# Altium project Common_ASIC_tester.PrjPcb (part 2 of 2)

## Sheet POWER.SchDoc: Panel
size 420 x 297 mm; Author: G.Kasprowicz; CompanyName: WUT ISE; DrawnBy: G.Kasprowicz; Organization: WUT ISE; Address1: PW ISE; Address2: Nowowiejska 15/19 00-665 Warsaw; Address3: gkasprow@gmail.com; DocumentNumber: 3; Revision: 2; SheetNumber: 3; SheetTotal: 3; ModifiedBy: -; CheckedDate: -; Title2: Power supply; DivGrp: WUT ISE; Designer: G.Kasprowicz; ModifiedDate: -; ProjectName: Sensor Box
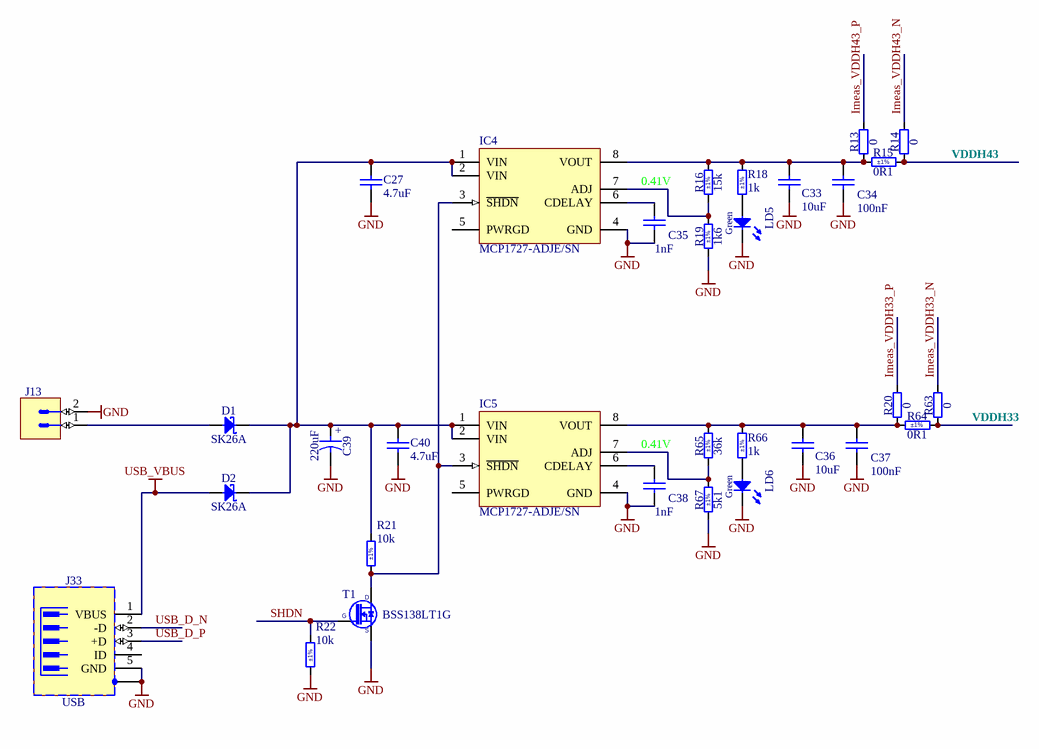
[diagram p3: POWER.SchDoc]

### Parts
C27  4.7uF  [CAPC1005X55N]
C33  10uF  [CAPC1608X80N]
C34  100nF  [CAPC1005X55N]
C35  1nF  [CAPC1005X55N]
C36  10uF  [CAPC1608X80N]
C37  100nF  [CAPC1005X55N]
C38  1nF  [CAPC1005X55N]
C39  220uF  [CAPMP7343X430N]
C40  4.7uF  [CAPC1005X55N]
D1  SK26A  [DIOM5126X265N]
D2  SK26A  [DIOM5126X265N]
IC4  MCP1727-ADJE/SN  [SO-8]
IC5  MCP1727-ADJE/SN  [SO-8]
J13  (no value)  [PHOENIX_1755736]
J33  USB  [MOLEX_500075-1517]
LD5  Green  [LED_KINGBRIGHT_KP-1608CGCK]
LD6  Green  [LED_KINGBRIGHT_KP-1608CGCK]
R13  0  [RESC1005X40N]
R14  0  [RESC1005X40N]
R15  0R1  Tolerance: ±1%  [RESC1608X55N]
R16  15k  Tolerance: ±1%  [RESC1005X40N]
R18  1k  Tolerance: ±1%  [RESC1005X40N]
R19  1k6  Tolerance: ±1%  [RESC1005X40N]
R20  0  [RESC1005X40N]
R21  10k  Tolerance: ±1%  [RESC1005X40N]
R22  10k  Tolerance: ±1%  [RESC1005X40N]
R63  0  [RESC1005X40N]
R64  0R1  Tolerance: ±1%  [RESC1608X55N]
R65  36k  Tolerance: ±1%  [RESC1005X40N]
R66  1k  Tolerance: ±1%  [RESC1005X40N]
R67  5k1  Tolerance: ±1%  [RESC1005X40N]
T1  BSS138LT1G  [SOT95P240X110-3N]

### Nets
GND: C27.1 C33.1 C34.1 C35.1 C36.1 C37.1 C38.1 C39.2 C40.1 IC4.4(GND) IC5.4(GND) J13.2 J33.5(GND) J33.6(SH) LD5.1(C) LD6.1(C) R19.1 R22.2 R67.1 T1.2(S)
USB_VBUS: D2.2(A) J33.1(VBUS)
Imeas_VDDH33_N: R63.2
Imeas_VDDH33_P: R20.2
Imeas_VDDH43_N: R14.2
Imeas_VDDH43_P: R13.2
SHDN: R22.1 T1.1(G)
USB_D_N: J33.2(-D)
USB_D_P: J33.3(+D)
VDDH33: R63.1 R64.2
VDDH43: R14.1 R15.2
NetC27_2: C27.2 C39.1 C40.2 D1.1(C) D2.1(C) IC4.1(VIN) IC4.2(VIN) IC5.1(VIN) IC5.2(VIN) R21.1
NetC33_2: C33.2 C34.2 IC4.8(VOUT) R13.1 R15.1 R16.2 R18.2
NetC35_2: C35.2 IC4.6(CDELAY)
NetC36_2: C36.2 C37.2 IC5.8(VOUT) R20.1 R64.1 R65.2 R66.2
NetC38_2: C38.2 IC5.6(CDELAY)
NetD1_2: D1.2(A) J13.1
NetIC4_3: IC4.3(~{SHDN}) IC5.3(~{SHDN}) R21.2 T1.3(D)
NetIC4_7: IC4.7(ADJ) R16.1 R19.2
NetIC5_7: IC5.7(ADJ) R65.1 R67.2
NetLD5_2: LD5.2(A) R18.1
NetLD6_2: LD6.2(A) R66.1

Not connected (* = marked no-connect by the designer): IC4 5(PWRGD); IC5 5(PWRGD); J33 4(ID)

### Notes on the sheet
- 0.41V
- Project/Equipment
- Document
- Designer
- Drawn by
- Check.by
- Copyright WUT ISE 2020.
  This documentation describes Open Hardware and is licensed under the CERN OHL v.1.2. You may redistribute and modify this documentation under the terms of the CERN OHL v.1.2. (http://ohwr.org/CERNOHL). This documentation is distributed WITHOUT ANY EXPRESS OR IMPLIED WARRANTY, INCLUDING OF MERCHANTABILITY, SATISFACTORY QUALITY AND FITNESS FOR A PARTICULAR PURPOSE. Please see the CERN OHL v.1.2 for applicable conditions.
- Contact
- File
- Last Mod.
- Print Date
- Sheet
- Size
- A3
- of
- Rev
- (in symbol CTE7343-43_220UF_16V_10%) +

### Library data of the parts
C27 C40 = CC0402_4.7UF_10V_10%_X5R: Non-polarised capacitor; Part Description: SMD Multilayer Chip Ceramic Capacitor; Manufacturer: GENERIC; Manufacturer1 Part Number: C1005X5R1A475K050; Voltage: 10V; TC: X5R; Tolerance: ±10%; Value: 4.7uF; Part Number: CC0402_4.7UF_10V_10%_X5R; Component Kind: Standard; Component Type: Standard; Pin Count: 2; Status: Preferred; Manufacturer Part Number: CC0402_4.7UF_10V_10%_X5R; Case: 0402; Mounted: Yes; Socket: No; SMD: Yes; Sense: No; Manufacturer1 Example: TDK; Manufacturer1 ComponentHeight: 0.65mm; HelpURL: \\cern.ch\dfs\Applications\Altium\Datasheets\CC0402_X5R_TDK_C.pdf; Author: CERN DEM BC; CreateDate: 10.01.2020; LatestRevisionDate: 10.01.2020
C33 C36 = CC0603_10UF_10V_10%_X5R: Non-polarised capacitor; Part Description: SMD Multilayer Chip Ceramic Capacitor; Manufacturer: GENERIC; Manufacturer1 Part Number: GRM188R61A106KE69D; Voltage: 10V; TC: X5R; Tolerance: ±10%; Value: 10uF; Part Number: CC0603_10UF_10V_10%_X5R; Component Kind: Standard; Component Type: Standard; Pin Count: 2; Status: None; Manufacturer Part Number: CC0603_10UF_10V_10%_X5R; Case: 0603; Mounted: Yes; Socket: No; SMD: Yes; Sense: No; Manufacturer1 Example: MURATA; Manufacturer1 ComponentHeight: 0.8mm; HelpURL: \\cern.ch\dfs\Applications\Altium\Datasheets\CC0603_MURATA_GRM188R61A106KE69D.pdf; Author: CERN DEM JLC; CreateDate: 31.01.2017; LatestRevisionDate: 31.01.2017
C34 C37 = CC0402_100NF_16V_10%_X5R: Non-polarised capacitor; Part Description: SMD Multilayer Chip Ceramic Capacitor; Manufacturer: GENERIC; Manufacturer1 Part Number: GRM155R61C104KA88D; Voltage: 16V; TC: X5R; Tolerance: ±10%; Value: 100nF; Part Number: CC0402_100NF_16V_10%_X5R; Component Kind: Standard; Component Type: Standard; Pin Count: 2; Status: None; Manufacturer Part Number: CC0402_100NF_16V_10%_X5R; Case: 0402; Mounted: Yes; Socket: No; SMD: Yes; Sense: No; Manufacturer1 Example: MURATA; Manufacturer1 ComponentHeight: 0.55mm; HelpURL: \\cern.ch\dfs\Applications\Altium\Datasheets\CC0402_X5R_MURATA_GRM.pdf; Author: CERN DEM JLC; CreateDate: 10.12.2013; LatestRevisionDate: 10.12.2013
C35 C38 = CC0402_1NF_50V_5%_C0G: Non-polarised capacitor; Part Description: SMD Multilayer Chip Ceramic Capacitor; Manufacturer: GENERIC; Manufacturer1 Part Number: C0402C102J5GACTU; Voltage: 50V; TC: C0G/NP0; Tolerance: ±5%; Value: 1nF; Part Number: CC0402_1NF_50V_5%_C0G; Component Kind: Standard; Component Type: Standard; Pin Count: 2; Status: Preferred; Manufacturer Part Number: CC0402_1NF_50V_5%_C0G; Case: 0402; Mounted: Yes; Socket: No; SMD: Yes; Sense: No; Manufacturer1 Example: KEMET; Manufacturer1 ComponentHeight: 0.55mm; HelpURL: \\cern.ch\dfs\Applications\Altium\Datasheets\CC0402_C0G_KEMET_(Commercial Grade).pdf; Author: CERN DEM BC; CreateDate: 02.09.2019; LatestRevisionDate: 02.09.2019
C39 = CTE7343-43_220UF_16V_10%: Polarised capacitor; Part Description: Solid Tantalum Chip Capacitor; Manufacturer: GENERIC; Manufacturer1 Part Number: TAJE227K016R; Voltage: 16V; Tolerance: ±10%; Part Number: CTE7343-43_220UF_16V_10%; Component Kind: Standard; Component Type: Standard; Pin Count: 2; Value: 220uF; Status: Preferred; Manufacturer Part Number: CTE7343-43_220UF_16V_10%; Case: E; Mounted: Yes; Socket: No; SMD: Yes; Sense: No; Manufacturer1 Example: AVX; Manufacturer1 ComponentHeight: 4.3mm; HelpURL: \\cern.ch\dfs\Applications\Altium\Datasheets\CTE_AVX_TAJ.pdf; Author: CERN DEM JLC; CreateDate: 03.12.2007; LatestRevisionDate: 03.12.2007
D1 D2 = SK26A: Schottky Diode; Part Description: 2A, 60V Surface Mount Schottky Barrier Rectifier; Manufacturer: TAIWAN SEMICONDUCTOR; Voltage: 60V; Power: 2A; PressFit: No; Bonding: No; Part Number: SK26A; Component Kind: Standard; Component Type: Standard; Device: SK26A; PackageDescription: DO-214-AC/SMA Molded Diode, 2-Leads, Body 5.1x2.6mm, IPC Medium Density; Manufacturer Part Number: SK26A; Pin Count: 2; Case: DO-214AC; Mounted: Yes; Socket: No; SMD: Yes; Sense: No; ComponentHeight: 2.5mm; HelpURL: \\cern.ch\dfs\Applications\Altium\Datasheets\SK26A.pdf; Author: CERN DEM JMW; CreateDate: 07.08.2015; LatestRevisionDate: 07.08.2015
IC4 IC5 = MCP1727-ADJE/SN: 1.5A, Low Voltage, Low Quiescent Current LDO Regulator, 8-Pin SOIC 150mil, Extended Temperature; Value: MCP1726-ADJE/SN; Published: 29-Jan-2009; DatasheetVersion: revB, Feb-2007; PackageVersion: revAW, Oct-2008; PackageReference: SOIC-SN8; Publisher: Altium Limited; PackageDescription: 8-Lead Plastic Small Outline (SN) - Narrow, 3.90mm Body [SOIC]; Code_JEDEC: MS-012; Code_IPC: SOIC127P600-8; ComponentLink1Description: Manufacturer Link; ComponentLink1URL: http://www.microchip.com; ComponentLink2Description: Datasheet; ComponentLink2URL: http://ww1.microchip.com/downloads/en/DeviceDoc/21999b.pdf; ComponentLink3Description: Packaging Specification; ComponentLink3URL: http://ww1.microchip.com/downloads/en/PackagingSpec/00049AW.pdf
J13 = PHOENIX_1755736: Connector 2 Male; Part Description: 12A, 250V, Pitch 5.08mm, 2 Positions Header; Manufacturer: PHOENIX CONTACT; Manufacturer Part Number: 1755736 (MSTBVA 2,5/ 2-G-5,08); PressFit: No; Part Number: PHOENIX_1755736; Component Kind: Standard; Component Type: Standard; Pin Count: 2; Mounted: Yes; Socket: No; SMD: No; Sense: No; Status: None; ComponentHeight: 12mm; HelpURL: \\cern.ch\dfs\Applications\Altium\Datasheets\PHOENIX_1755736.pdf; Author: CERN DEM JLC; CreateDate: 07.12.2010; LatestRevisionDate: 07.12.2010
J33 = MOLEX_500075-1517: 5 Pin + 1 Shield USB Receptacle; Part Description: USB Mini-B Serie Type 2, Through Hole Straight Receptacle; Manufacturer: MOLEX; PressFit: No; Part Number: MOLEX_500075-1517; Component Kind: Standard; Component Type: Standard; Pin Count: 6; Family: USB; Mounted: Yes; Socket: No; SMD: No; Sense: No; Status: None; Manufacturer Part Number: 500075-1517; ComponentHeight: 7.7mm; HelpURL: \\cern.ch\dfs\Applications\Altium\Datasheets\MOLEX_500075-1517.pdf; Author: CERN DEM JLC; CreateDate: 25.07.2012; LatestRevisionDate: 25.07.2012
LD5 LD6 = LED_KINGBRIGHT_KP-1608CGCK: LED Green 1C 2A; Part Description: 1.6x0.8mm SMD Chip Green LED Lamp; PressFit: No; Bonding: No; Part Number: LED_KINGBRIGHT_KP-1608CGCK; Component Kind: Standard; Component Type: Standard; Color: Green; PackageDescription: SMT Green LED, Case 0603, Body L 1.60mm x W 0.80mm x H 1.10mm; Manufacturer: KINGBRIGHT; Manufacturer Part Number: KP-1608CGCK; Pin Count: 2; Case: 0603; Mounted: Yes; Socket: No; SMD: Yes; Sense: No; ComponentHeight: 1.1mm; HelpURL: \\cern.ch\dfs\Applications\Altium\Datasheets\LED_KINGBRIGHT_KP-1608CGCK.pdf; Author: CERN DEM HF; CreateDate: 01.10.2021; LatestRevisionDate: 01.10.2021
R13 R14 R20 R63 = R0402_0R_JUMPER: Resistor; Part Description: 1A (0.05R Max DC Resistance) Zero Ohm Jumper; Manufacturer: GENERIC; Manufacturer1 Part Number: 232270591001L; PressFit: No; Part Number: R0402_0R_JUMPER; Component Kind: Standard; Component Type: Standard; Pin Count: 2; Value: 0; Status: Not Recommended; Manufacturer Part Number: R0402_0R_JUMPER; Case: 0402; Mounted: Yes; Sense: No; Socket: No; SMD: Yes; Manufacturer1 Example: YAGEO PHYCOMP; Manufacturer1 ComponentHeight: 0.4mm; HelpURL: \\cern.ch\dfs\Applications\Altium\Datasheets\R0402_Phycomp_RC0402.pdf; Author: CERN DEM JLC; CreateDate: 03.12.2007; LatestRevisionDate: 17.10.2012
R15 R64 = R0603_0R1_1%_0.1W_200PPM: Resistor - 1%; Part Description: Low Value Chip Resistor; Manufacturer: GENERIC; Manufacturer1 Part Number: CRL0603-FW-R100ELF; Power: 0.1W; TC: ±200ppm/°C; PressFit: No; Part Number: R0603_0R1_1%_0.1W_200PPM; Component Kind: Standard; Component Type: Standard; Pin Count: 2; Value: 0R1; Status: Preferred; Manufacturer Part Number: R0603_0R1_1%_0.1W_200PPM; Case: 0603; Mounted: Yes; Sense: No; Socket: No; SMD: Yes; Manufacturer1 Example: BOURNS; Manufacturer1 ComponentHeight: 0.55mm; HelpURL: \\cern.ch\dfs\Applications\Altium\Datasheets\R0603_BOURNS_CRL.pdf; Author: CERN DEM JMW; CreateDate: 26.11.2019; LatestRevisionDate: 26.11.2019
R16 = R0402_15K_1%_0.0625W_100PPM: Resistor - 1%; Part Description: General Purpose Thick Film Chip Resistor; Manufacturer: GENERIC; Manufacturer1 Part Number: CRCW040215K0FK; TC: ±100ppm/°C; PressFit: No; Part Number: R0402_15K_1%_0.0625W_100PPM; Component Kind: Standard; Component Type: Standard; Pin Count: 2; Value: 15k; Status: None; Power: 0.0625W; Manufacturer Part Number: R0402_15K_1%_0.0625W_100PPM; Case: 0402; Mounted: Yes; Sense: No; Socket: No; SMD: Yes; Manufacturer1 Example: VISHAY; Manufacturer1 ComponentHeight: 0.4mm; HelpURL: \\cern.ch\dfs\Applications\Altium\Datasheets\R0402_VISHAY_CRCW e3.pdf; Author: CERN DEM JMW; CreateDate: 06.07.2015; LatestRevisionDate: 06.07.2015
R18 R66 = R0402_1K_1%_0.0625W_100PPM: Resistor - 1%; Part Description: General Purpose Thick Film Chip Resistor; Manufacturer: GENERIC; Manufacturer1 Part Number: 232270671002L; TC: ±100ppm/°C; PressFit: No; Value: 1k; Part Number: R0402_1K_1%_0.0625W_100PPM; Component Kind: Standard; Component Type: Standard; Pin Count: 2; Status: Not Recommended; Power: 0.0625W; Manufacturer Part Number: R0402_1K_1%_0.0625W_100PPM; Case: 0402; Mounted: Yes; Sense: No; Socket: No; SMD: Yes; Manufacturer1 Example: YAGEO PHYCOMP; Manufacturer1 ComponentHeight: 0.4mm; HelpURL: \\cern.ch\dfs\Applications\Altium\Datasheets\R0402_Phycomp_RC0402.pdf; Author: CERN DEM JLC; CreateDate: 03.12.2007; LatestRevisionDate: 17.10.2012
R19 = R0402_1K6_1%_0.0625W_100PPM: Resistor - 1%; Part Description: General Purpose Thick Film Chip Resistor; Manufacturer: GENERIC; Manufacturer1 Part Number: 232270671602L; TC: ±100ppm/°C; PressFit: No; Part Number: R0402_1K6_1%_0.0625W_100PPM; Component Kind: Standard; Component Type: Standard; Pin Count: 2; Value: 1k6; Status: Not Recommended; Power: 0.0625W; Manufacturer Part Number: R0402_1K6_1%_0.0625W_100PPM; Case: 0402; Mounted: Yes; Sense: No; Socket: No; SMD: Yes; Manufacturer1 Example: YAGEO PHYCOMP; Manufacturer1 ComponentHeight: 0.4mm; HelpURL: \\cern.ch\dfs\Applications\Altium\Datasheets\R0402_Phycomp_RC0402.pdf; Author: CERN DEM JLC; CreateDate: 03.12.2007; LatestRevisionDate: 17.10.2012
R21 R22 = R0402_10K_1%_0.0625W_100PPM: Resistor - 1%; Part Description: General Purpose Thick Film Chip Resistor; Manufacturer: GENERIC; Manufacturer1 Part Number: 232270671003L; TC: ±100ppm/°C; PressFit: No; Value: 10k; Part Number: R0402_10K_1%_0.0625W_100PPM; Component Kind: Standard; Component Type: Standard; Pin Count: 2; Status: Not Recommended; Power: 0.0625W; Manufacturer Part Number: R0402_10K_1%_0.0625W_100PPM; Case: 0402; Mounted: Yes; Sense: No; Socket: No; SMD: Yes; Manufacturer1 Example: YAGEO PHYCOMP; Manufacturer1 ComponentHeight: 0.4mm; HelpURL: \\cern.ch\dfs\Applications\Altium\Datasheets\R0402_Phycomp_RC0402.pdf; Author: CERN DEM JLC; CreateDate: 03.12.2007; LatestRevisionDate: 17.10.2012
R65 = R0402_36K_1%_0.0625W_100PPM: Resistor - 1%; Part Description: General Purpose Thick Film Chip Resistor; Manufacturer: GENERIC; Manufacturer1 Part Number: 232270673603L; TC: ±100ppm/°C; PressFit: No; Part Number: R0402_36K_1%_0.0625W_100PPM; Component Kind: Standard; Component Type: Standard; Pin Count: 2; Value: 36k; Status: Not Recommended; Power: 0.0625W; Manufacturer Part Number: R0402_36K_1%_0.0625W_100PPM; Case: 0402; Mounted: Yes; Sense: No; Socket: No; SMD: Yes; Manufacturer1 Example: YAGEO PHYCOMP; Manufacturer1 ComponentHeight: 0.4mm; HelpURL: \\cern.ch\dfs\Applications\Altium\Datasheets\R0402_Phycomp_RC0402.pdf; Author: CERN DEM JLC; CreateDate: 03.12.2007; LatestRevisionDate: 17.10.2012
R67 = R0402_5K1_1%_0.0625W_100PPM: Resistor - 1%; Part Description: General Purpose Thick Film Chip Resistor; Manufacturer: GENERIC; Manufacturer1 Part Number: 232270675102L; TC: ±100ppm/°C; PressFit: No; Part Number: R0402_5K1_1%_0.0625W_100PPM; Component Kind: Standard; Component Type: Standard; Pin Count: 2; Value: 5k1; Status: Not Recommended; Power: 0.0625W; Manufacturer Part Number: R0402_5K1_1%_0.0625W_100PPM; Case: 0402; Mounted: Yes; Sense: No; Socket: No; SMD: Yes; Manufacturer1 Example: YAGEO PHYCOMP; Manufacturer1 ComponentHeight: 0.4mm; HelpURL: \\cern.ch\dfs\Applications\Altium\Datasheets\R0402_Phycomp_RC0402.pdf; Author: CERN DEM JLC; CreateDate: 03.12.2007; LatestRevisionDate: 17.10.2012
T1 = BSS138LT1G: N-CHANNEL MOSFET WITH DIODE; Part Description: 50V, 200mA N-Channel Enhancement Mode Field-Effect Transistor; Manufacturer: ON SEMICONDUCTOR; PressFit: No; Bonding: No; Part Number: BSS138LT1G; Component Kind: Standard; Component Type: Standard; Device: BSS138LT1G; PackageDescription: SOT23, 0.95mm Pitch; 3 Pin, 1.40mm W X 3.00mm L X 1.10mm H body, IPC Medium Density; Manufacturer Part Number: BSS138LT1G; Pin Count: 3; Case: SOT23-3; Mounted: Yes; Socket: No; SMD: Yes; Sense: No; ComponentHeight: 1.11mm; HelpURL: \\cern.ch\dfs\Applications\Altium\Datasheets\BSS138LT1G.pdf; Author: CERN DEM JLC; CreateDate: 23.03.2009; LatestRevisionDate: 23.03.2009

## Nets that join several sheets
GND: Connectors (57 pins), DIGITAL (32 pins), MAIN (53 pins), POWER (20 pins)
USB_VBUS: Connectors (R51.2), DIGITAL (C1.2 IC3.7 IC3.8), POWER (D2.2 J33.1)
DBG_BREAK: Connectors (J25.8 R30.1 SW2.3), MAIN (J27.8 U1.75)
DBG_EN: Connectors (J25.6 R28.1 SW1.3 T2.3), MAIN (J27.6 U1.74)
DBG_RX: Connectors (J25.12), DIGITAL (IC2.13), MAIN (J27.12 U1.77)
DBG_TX: Connectors (J25.10), DIGITAL (IC2.11), MAIN (J27.10 U1.76)
DC_DC_EN: Connectors (J24.18 R32.2 R34.1), MAIN (J1.18 U1.63)
GPIO24/vref_1v0: Connectors (J2.8 J23.16), MAIN (J26.16 U1.43)
GPIO25isource_4u: Connectors (J2.20 J23.18), MAIN (J26.18 U1.44)
GPIO26/testclk: Connectors (J8.1 J24.2), MAIN (J1.2 R62.2)
GPIO27/testclk: Connectors (J7.1 J24.4), MAIN (J1.4 R61.2)
GPIO28/testclk: Connectors (J6.1 J24.6), MAIN (J1.6 R60.2)
GPIO29/testclk: Connectors (J5.1 J24.8), MAIN (J1.8 R59.2)
Imeas_VDD18GO_N: Connectors (J16.1 J25.11), MAIN (J27.11 R52.2)
Imeas_VDD18GO_P: Connectors (J16.14 J25.9), MAIN (J27.9 R27.2)
Imeas_VDD22_N: Connectors (J16.2 J25.7), MAIN (J27.7 R58.2)
Imeas_VDD22_P: Connectors (J16.15 J25.5), MAIN (J27.5 R57.2)
Imeas_VDDH33_N: Connectors (R40.2), POWER (R63.2)
Imeas_VDDH33_P: Connectors (R38.2), POWER (R20.2)
Imeas_VDDH43_N: Connectors (R44.2), POWER (R14.2)
Imeas_VDDH43_P: Connectors (R42.2), POWER (R13.2)
IO_DBG_ENn: Connectors (R29.1 T2.1), DIGITAL (IC3.17 R10.2)
IO_LDO_ENn: Connectors (R33.1 T3.1), DIGITAL (IC3.16 R8.2)
IO_USB_RST: Connectors (R36.1 T4.1), DIGITAL (IC3.18 R11.2)
LDO_EN: Connectors (J24.16 R31.2 SW3.3 T3.3), MAIN (J1.16 U1.62)
LDOGPIO_FB: Connectors (J2.7 J24.15), MAIN (J1.15 R54.2 R55.1 U1.66)
LNA_OUT1: Connectors (J18.1 J19.1), MAIN (J29.1 U1.19)
LNA_OUT5: Connectors (J9.1 J10.1), MAIN (J31.1 U1.25)
MIX1_IN: Connectors (J20.1 J21.1), MAIN (J28.1 U1.17)
MIX5_IN: Connectors (J11.1 J12.1), MAIN (J32.1 U1.27)
OSC_16M: Connectors (J23.11), DIGITAL (C6.2), MAIN (C24.1 J26.11 R25.2)
OSC_32k: Connectors (J24.14), DIGITAL (OSC1.3), MAIN (C16.1 J1.14)
RF_IN: Connectors (J14.1 J15.1), MAIN (J30.1 U1.22)
RSTN: Connectors (J24.12 R35.1 SW5.3 T4.3), MAIN (J1.12 U1.53)
RTCK: Connectors (J25.18), DIGITAL (J17.11 R6.1), MAIN (J27.18 U1.79)
SHDN: DIGITAL (IC3.19 R12.2), POWER (R22.1 T1.1)
TCK: Connectors (J25.19), DIGITAL (J17.9 R5.1), MAIN (J27.19 U1.80)
TDI: Connectors (J25.13), DIGITAL (J17.5 R3.1), MAIN (J27.13 U1.82)
TDO: Connectors (J25.14), DIGITAL (J17.13 R9.1), MAIN (J27.14 U1.78)
Test_CAP: Connectors (J3.1 J23.15), MAIN (C21.2 J26.15)
Thermometer_1_1: Connectors (J22.1 J24.7), MAIN (B1.1 J1.7)
Thermometer_1_2: Connectors (J22.2 J24.9), MAIN (B2.1 J1.9)
Thermometer_1_3: Connectors (J22.7 J24.11), MAIN (B3.1 J1.11)
Thermometer_1_4: Connectors (J22.8 J24.13), MAIN (B4.1 J1.13)
TMS: Connectors (J25.15), DIGITAL (J17.7 R4.1), MAIN (J27.15 U1.81)
USB_D_N: DIGITAL (IC3.4), POWER (J33.2)
USB_D_P: DIGITAL (IC3.3), POWER (J33.3)
VDD15_ADC: Connectors (J2.2 J23.12), MAIN (C30.2 J26.12 U1.31)
VDD15_APLL1: Connectors (J2.16 J23.3), MAIN (C22.2 J26.3 U1.14)
VDD15_APLL5: Connectors (J2.3 J23.8), MAIN (C65.2 J26.8 U1.29)
VDD15_DPLL: Connectors (J2.15 J23.10), MAIN (C29.2 J26.10 U1.30)
VDD15_IF: Connectors (J2.17 J23.5), MAIN (C17.2 J26.5 U1.13)
VDD15_RFO: Connectors (J2.14 J23.4), MAIN (C28.2 J26.4 U1.23)
VDD15FLO: Connectors (J2.1 J25.4), MAIN (C19.1 J27.4 U1.71)
VDD15MCUO: Connectors (J2.18 J25.2), MAIN (C18.1 J27.2 U1.69)
VDD15RTC: Connectors (J2.4 J24.1), MAIN (C14.1 J1.1 U1.58)
VDD18GO: Connectors (5 pins), DIGITAL (9 pins), MAIN (14 pins)
VDD22_RFI: Connectors (J2.19 J23.2), MAIN (5 pins)
VDD22DCDC: Connectors (J4.1 J24.19), MAIN (J1.19 R56.2)
VDD22LDO_FB: Connectors (J2.6 J23.6), MAIN (9 pins)
VDDH33: Connectors (R46.2), DIGITAL (6 pins), POWER (R63.1 R64.2)
VDDH43: Connectors (5 pins), MAIN (6 pins), POWER (R14.1 R15.2)